# Altium schematic sheet Voltage Regulation.SchDoc: Voltage Regulation
size A4; Date: 2016/01/05; Author: Samuel López; DocumentNumber: 4; SheetNumber: 4; SheetTotal: 7; Project: H2H Main Board
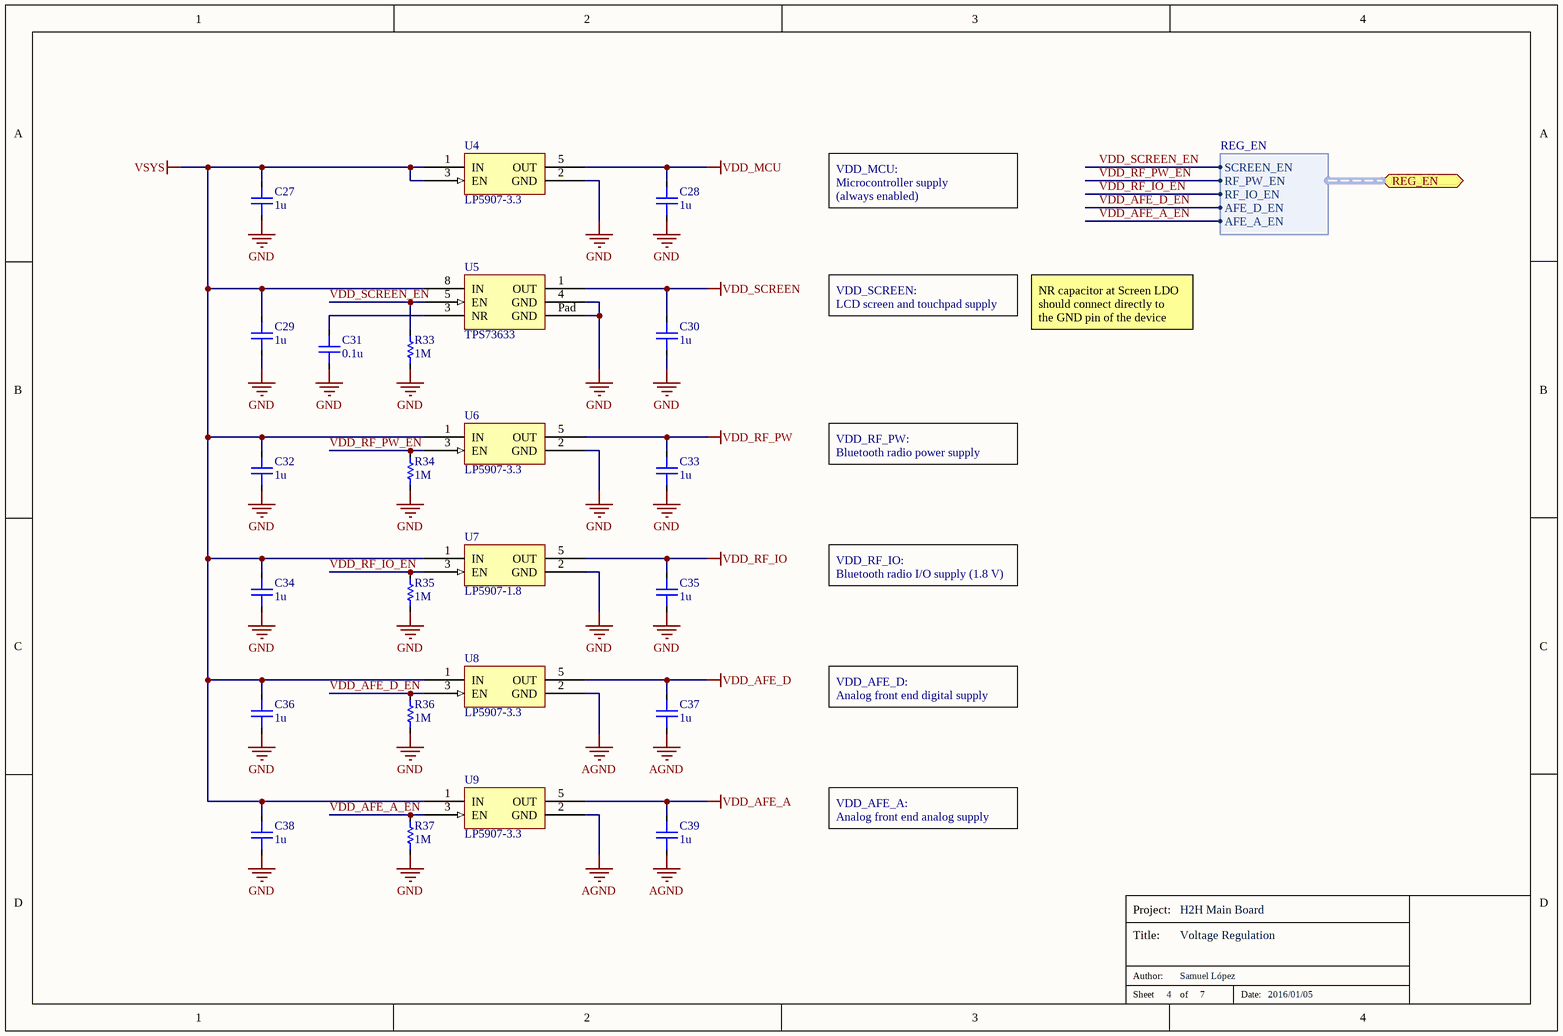
[diagram p0: Voltage Regulation.SchDoc]

## Parts
C27  1u  [C0603]
C28  1u  [C0603]
C29  1u  [C0603]
C30  1u  [C0603]
C31  0.1u  [C0603]
C32  1u  [C0603]
C33  1u  [C0603]
C34  1u  [C0603]
C35  1u  [C0603]
C36  1u  [C0603]
C37  1u  [C0603]
C38  1u  [C0603]
C39  1u  [C0603]
R33  1M  [R0603]
R34  1M  [R0603]
R35  1M  [R0603]
R36  1M  [R0603]
R37  1M  [R0603]
U4  LP5907-3.3  [LP5907]
U5  TPS73633  [TPS73633]
U6  LP5907-3.3  [LP5907]
U7  LP5907-1.8  [LP5907]
U8  LP5907-3.3  [LP5907]
U9  LP5907-3.3  [LP5907]

## Ports
REG_EN (harness REG_EN)

## Harnesses
REG_EN: SCREEN_EN, RF_PW_EN, RF_IO_EN, AFE_D_EN, AFE_A_EN

## Nets
AGND: C37.1 C39.1 U8.2(GND) U9.2(GND)
GND: C27.1 C28.1 C29.1 C30.1 C31.1 C32.1 C33.1 C34.1 C35.1 C36.1 C38.1 R33.2 R34.2 R35.2 R36.2 R37.2 U4.2(GND) U5.4(GND) U5.Pad(GND) U6.2(GND) U7.2(GND)
VDD_AFE_A: C39.2 U9.5(OUT)
VDD_AFE_D: C37.2 U8.5(OUT)
VDD_MCU: C28.2 U4.5(OUT)
VDD_RF_IO: C35.2 U7.5(OUT)
VDD_RF_PW: C33.2 U6.5(OUT)
VDD_SCREEN: C30.2 U5.1(OUT)
VSYS: C27.2 C29.2 C32.2 C34.2 C36.2 C38.2 U4.1(IN) U4.3(EN) U5.8(IN) U6.1(IN) U7.1(IN) U8.1(IN) U9.1(IN)
VDD_AFE_A_EN: R37.1 U9.3(EN) ; port REG_EN.AFE_A_EN
VDD_AFE_D_EN: R36.1 U8.3(EN) ; port REG_EN.AFE_D_EN
VDD_RF_IO_EN: R35.1 U7.3(EN) ; port REG_EN.RF_IO_EN
VDD_RF_PW_EN: R34.1 U6.3(EN) ; port REG_EN.RF_PW_EN
VDD_SCREEN_EN: R33.1 U5.5(EN) ; port REG_EN.SCREEN_EN
NetC31_2: C31.2 U5.3(NR)

## Notes on the sheet
- VDD_MCU:
  Microcontroller supply
  (always enabled)
- VDD_SCREEN:
  LCD screen and touchpad supply
- NR capacitor at Screen LDO
  should connect directly to
  the GND pin of the device
- VDD_RF_PW:
  Bluetooth radio power supply
- VDD_RF_IO:
  Bluetooth radio I/O supply (1.8 V)
- VDD_AFE_D:
  Analog front end digital supply
- VDD_AFE_A:
  Analog front end analog supply
- Project:
- Title:
- Sheet
- Author:
- of
- Date:

## Library data of the parts
C27-C39 = Capacitor: Rated Voltage: *
  C27-C30 C32-C39: Value: 1u
  C31: Value: 0.1u
R33-R37 = Resistor: Value: 1M; Power: *
U4 U6 U8 U9 = LP5907-3.3: Voltage Regulator - Linear; Supplier 1: Digi-Key; Supplier Part Number 1: 296-38557-1-ND
U5 = TPS73633: Voltage Regulator - Linear; Supplier 1: Digi-Key; Supplier Part Number 1: 296-17884-1-ND
U7 = LP5907-1.8: Voltage Regulator - Linear; Supplier 1: Digi-Key; Supplier Part Number 1: 296-41463-1-ND